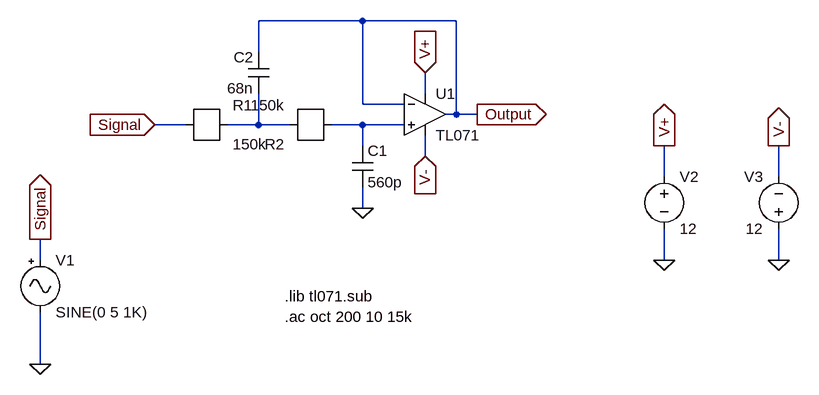
[diagram p0: schematic lowpass.asc]
lowpass.asc, the LTspice schematic file:
Version 4
SHEET 1 880 680
WIRE 128 64 -32 64
WIRE 272 64 128 64
WIRE -32 112 -32 64
WIRE 224 176 224 144
WIRE 128 192 128 64
WIRE 192 192 128 192
WIRE 272 208 272 64
WIRE 272 208 256 208
WIRE 304 208 272 208
WIRE -144 224 -192 224
WIRE -32 224 -32 176
WIRE -32 224 -80 224
WIRE 16 224 -32 224
WIRE 128 224 80 224
WIRE 192 224 128 224
WIRE 128 256 128 224
WIRE 224 272 224 240
WIRE 592 304 592 256
WIRE 768 304 768 256
WIRE 128 352 128 320
WIRE -368 432 -368 400
WIRE 592 432 592 384
WIRE 768 432 768 384
WIRE -368 592 -368 512
FLAG -368 592 0
FLAG 128 352 0
FLAG 592 432 0
FLAG 768 432 0
FLAG 592 256 V+
IOPIN 592 256 Out
FLAG 768 256 V-
IOPIN 768 256 Out
FLAG 224 144 V+
IOPIN 224 144 In
FLAG 224 272 V-
IOPIN 224 272 In
FLAG -368 400 Signal
IOPIN -368 400 Out
FLAG 304 208 Output
IOPIN 304 208 Out
FLAG -192 224 Signal
IOPIN -192 224 In
SYMBOL opamp2 224 144 R0
SYMATTR InstName U1
SYMATTR Value TL071
SYMBOL signal -368 416 R0
SYMATTR InstName V1
SYMATTR Value SINE(0 5 1K)
SYMATTR Value2 AC 5 0
SYMBOL voltage 592 288 R0
SYMATTR InstName V2
SYMATTR Value 12
SYMBOL voltage 768 400 R180
WINDOW 0 24 96 Left 2
WINDOW 3 24 16 Left 2
SYMATTR InstName V3
SYMATTR Value 12
SYMBOL r -144 224 R0
SYMATTR InstName R1
SYMATTR Value 150k
SYMBOL r 80 224 R180
SYMATTR InstName R2
SYMATTR Value 150k
SYMBOL cap 112 256 R0
SYMATTR InstName C1
SYMATTR Value 560p
SYMBOL cap -16 176 R180
WINDOW 0 24 56 Left 2
WINDOW 3 24 8 Left 2
SYMATTR InstName C2
SYMATTR Value 68n
TEXT 8 488 Left 2 !.lib tl071.sub\n.ac oct 200 10 15k

The netlist it stands for:
* lowpass.asc
XU1 N002 Output V+ V- Output TL071  ; pins In+ In- V+ V- OUT
V1 Signal 0 SINE(0 5 1K) AC 5 0
V2 V+ 0 12
V3 0 V- 12
R1 N001 Signal 150k
R2 N001 N002 150k
C1 N002 0 560p
C2 N001 Output 68n
.lib tl071.sub
.ac oct 200 10 15k
.backanno
.end